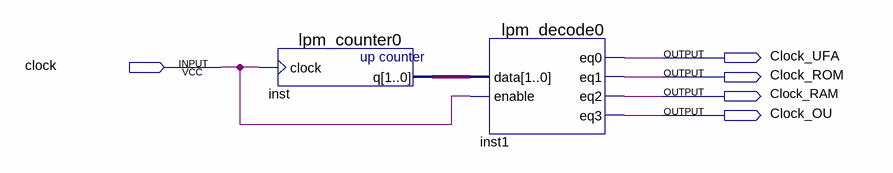
[diagram p0: schematic sheet]
// Quartus schematic clock_unit.bdf as structural Verilog: 2 symbols, 5 pins
module clock_unit (
  input  clock,
  output Clock_UFA,
  output Clock_ROM,
  output Clock_RAM,
  output Clock_OU
);

  wire [1:0] inst_q;

  lpm_counter0 inst (.clock(clock), .q(inst_q));
  lpm_decode0 inst1 (.data(inst_q), .enable(clock), .eq0(Clock_UFA), .eq1(Clock_ROM), .eq2(Clock_RAM), .eq3(Clock_OU));
endmodule
